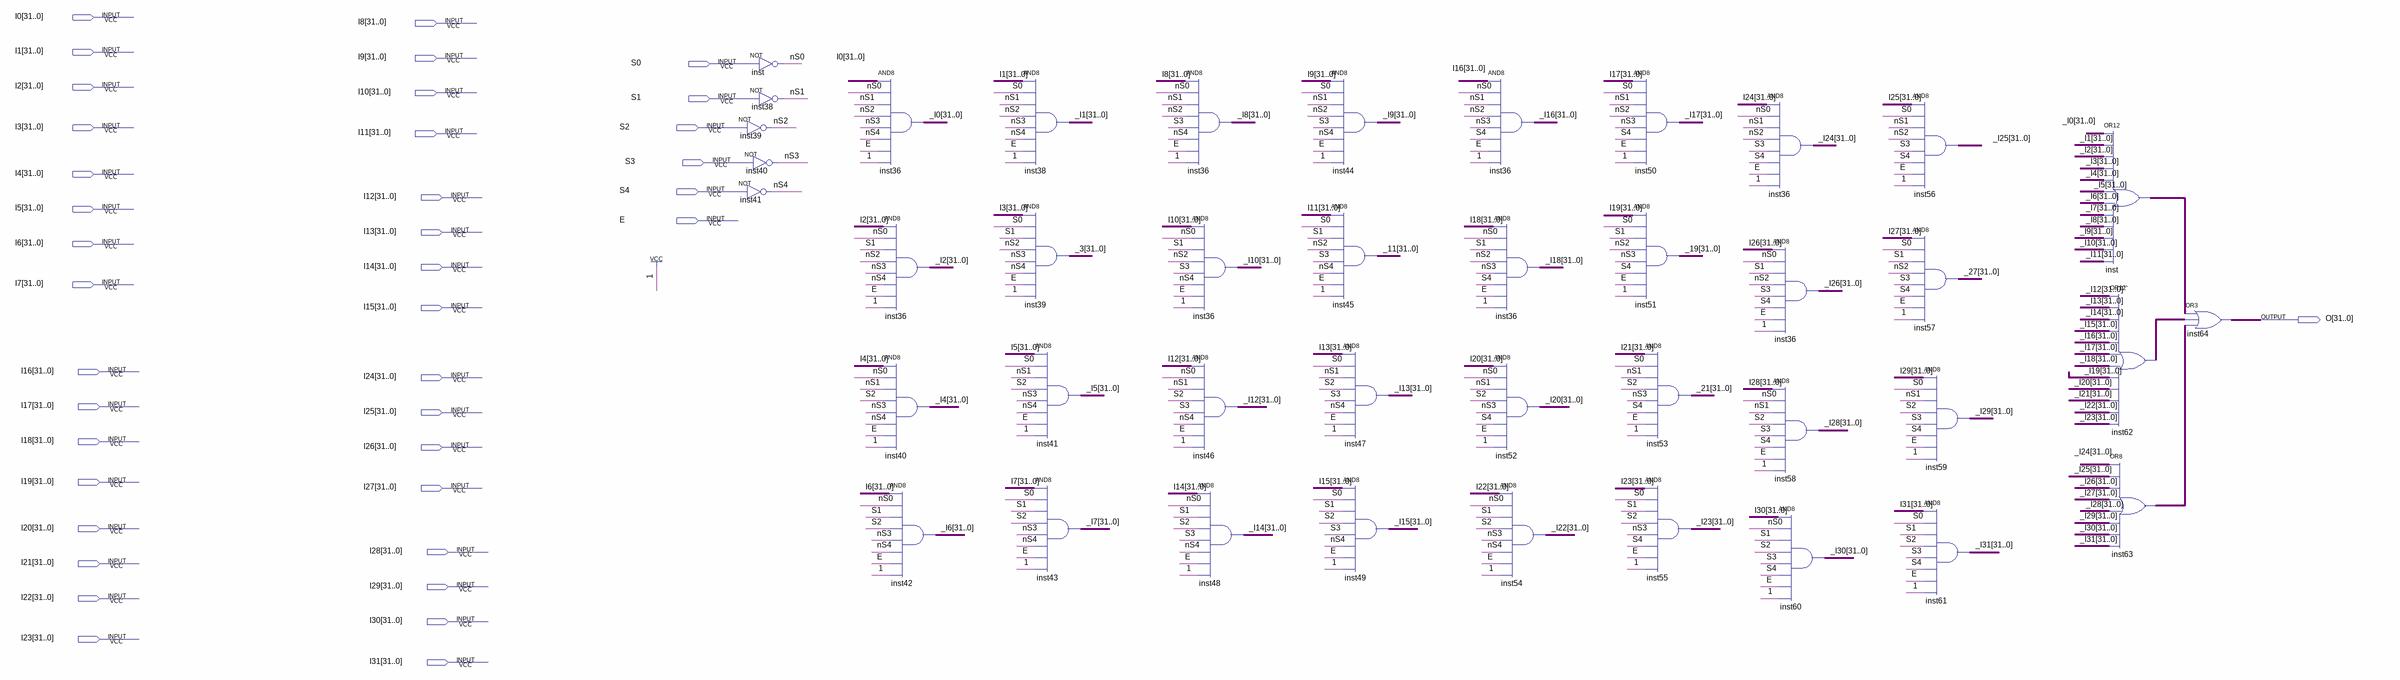
[diagram p0: schematic sheet]
// Quartus schematic MUX32_32.bdf as structural Verilog: 41 symbols, 39 pins
module MUX32_32 (
  input  [31:0] I0,
  input  [31:0] I8,
  input  [31:0] I1,
  input  [31:0] I9,
  input  S0,
  input  [31:0] I2,
  input  [31:0] I10,
  input  S1,
  input  [31:0] I3,
  input  S2,
  input  [31:0] I11,
  input  S3,
  input  [31:0] I4,
  input  S4,
  input  [31:0] I12,
  input  [31:0] I5,
  input  E,
  input  [31:0] I13,
  input  [31:0] I6,
  input  [31:0] I14,
  input  [31:0] I7,
  input  [31:0] I15,
  input  [31:0] I16,
  input  [31:0] I24,
  input  [31:0] I17,
  input  [31:0] I25,
  input  [31:0] I18,
  input  [31:0] I26,
  input  [31:0] I19,
  input  [31:0] I27,
  input  [31:0] I20,
  input  [31:0] I28,
  input  [31:0] I21,
  input  [31:0] I29,
  input  [31:0] I22,
  input  [31:0] I30,
  input  [31:0] I23,
  input  [31:0] I31,
  output [31:0] O
);

  wire \_I12[31..0]`` , nS0, nS1, nS2, nS3, nS4;
  wire [31:0] _3, _11, _19, _21, _27, _I0, _I1, _I2, _I3, _I4, _I5, _I6, _I7, _I8, _I9, _I10, _I11, _I12,
       _I13, _I14, _I15, _I16, _I17, _I18, _I19, _I20, _I21, _I22, _I23, _I24, _I25, _I26, _I27, _I28, _I29,
       _I30, _I31, inst62_out, inst63_out, inst_out;

  not inst (nS0, S0);
  not inst38 (nS1, S1);
  not inst39 (nS2, S2);
  not inst40 (nS3, S3);
  not inst41 (nS4, S4);
  assign _I0 = I0 & {32{nS0}} & {32{nS1}} & {32{nS2}} & {32{nS3}} & {32{nS4}} & {32{E}} & {32{1'b1}};  // AND8 inst36, 32 bits wide
  assign _I2 = I2 & {32{nS0}} & {32{S1}} & {32{nS2}} & {32{nS3}} & {32{nS4}} & {32{E}} & {32{1'b1}};  // AND8 inst36, 32 bits wide
  assign _I4 = I4 & {32{nS0}} & {32{nS1}} & {32{S2}} & {32{nS3}} & {32{nS4}} & {32{E}} & {32{1'b1}};  // AND8 inst40, 32 bits wide
  assign _I6 = I6 & {32{nS0}} & {32{S1}} & {32{S2}} & {32{nS3}} & {32{nS4}} & {32{E}} & {32{1'b1}};  // AND8 inst42, 32 bits wide
  assign _I1 = I1 & {32{S0}} & {32{nS1}} & {32{nS2}} & {32{nS3}} & {32{nS4}} & {32{E}} & {32{1'b1}};  // AND8 inst38, 32 bits wide
  assign _3 = I3 & {32{S0}} & {32{S1}} & {32{nS2}} & {32{nS3}} & {32{nS4}} & {32{E}} & {32{1'b1}};  // AND8 inst39, 32 bits wide
  assign _I5 = I5 & {32{S0}} & {32{nS1}} & {32{S2}} & {32{nS3}} & {32{nS4}} & {32{E}} & {32{1'b1}};  // AND8 inst41, 32 bits wide
  assign _I7 = I7 & {32{S0}} & {32{S1}} & {32{S2}} & {32{nS3}} & {32{nS4}} & {32{E}} & {32{1'b1}};  // AND8 inst43, 32 bits wide
  assign _I8 = I8 & {32{nS0}} & {32{nS1}} & {32{nS2}} & {32{S3}} & {32{nS4}} & {32{E}} & {32{1'b1}};  // AND8 inst36, 32 bits wide
  assign _I10 = I10 & {32{nS0}} & {32{S1}} & {32{nS2}} & {32{S3}} & {32{nS4}} & {32{E}} & {32{1'b1}};  // AND8 inst36, 32 bits wide
  assign _I12 = I12 & {32{nS0}} & {32{nS1}} & {32{S2}} & {32{S3}} & {32{nS4}} & {32{E}} & {32{1'b1}};  // AND8 inst46, 32 bits wide
  assign _I14 = I14 & {32{nS0}} & {32{S1}} & {32{S2}} & {32{S3}} & {32{nS4}} & {32{E}} & {32{1'b1}};  // AND8 inst48, 32 bits wide
  assign _I9 = I9 & {32{S0}} & {32{nS1}} & {32{nS2}} & {32{S3}} & {32{nS4}} & {32{E}} & {32{1'b1}};  // AND8 inst44, 32 bits wide
  assign _11 = I11 & {32{S0}} & {32{S1}} & {32{nS2}} & {32{S3}} & {32{nS4}} & {32{E}} & {32{1'b1}};  // AND8 inst45, 32 bits wide
  assign _I13 = I13 & {32{S0}} & {32{nS1}} & {32{S2}} & {32{S3}} & {32{nS4}} & {32{E}} & {32{1'b1}};  // AND8 inst47, 32 bits wide
  assign _I15 = I15 & {32{S0}} & {32{S1}} & {32{S2}} & {32{S3}} & {32{nS4}} & {32{E}} & {32{1'b1}};  // AND8 inst49, 32 bits wide
  assign _I16 = I16 & {32{nS0}} & {32{nS1}} & {32{nS2}} & {32{nS3}} & {32{S4}} & {32{E}} & {32{1'b1}};  // AND8 inst36, 32 bits wide
  assign _I18 = I18 & {32{nS0}} & {32{S1}} & {32{nS2}} & {32{nS3}} & {32{S4}} & {32{E}} & {32{1'b1}};  // AND8 inst36, 32 bits wide
  assign _I20 = I20 & {32{nS0}} & {32{nS1}} & {32{S2}} & {32{nS3}} & {32{S4}} & {32{E}} & {32{1'b1}};  // AND8 inst52, 32 bits wide
  assign _I22 = I22 & {32{nS0}} & {32{S1}} & {32{S2}} & {32{nS3}} & {32{nS4}} & {32{E}} & {32{1'b1}};  // AND8 inst54, 32 bits wide
  assign _I17 = I17 & {32{S0}} & {32{nS1}} & {32{nS2}} & {32{nS3}} & {32{S4}} & {32{E}} & {32{1'b1}};  // AND8 inst50, 32 bits wide
  assign _19 = I19 & {32{S0}} & {32{S1}} & {32{nS2}} & {32{nS3}} & {32{S4}} & {32{E}} & {32{1'b1}};  // AND8 inst51, 32 bits wide
  assign _21 = I21 & {32{S0}} & {32{nS1}} & {32{S2}} & {32{nS3}} & {32{S4}} & {32{E}} & {32{1'b1}};  // AND8 inst53, 32 bits wide
  assign _I23 = I23 & {32{S0}} & {32{S1}} & {32{S2}} & {32{nS3}} & {32{S4}} & {32{E}} & {32{1'b1}};  // AND8 inst55, 32 bits wide
  assign _I24 = I24 & {32{nS0}} & {32{nS1}} & {32{nS2}} & {32{S3}} & {32{S4}} & {32{E}} & {32{1'b1}};  // AND8 inst36, 32 bits wide
  assign _I26 = I26 & {32{nS0}} & {32{S1}} & {32{nS2}} & {32{S3}} & {32{S4}} & {32{E}} & {32{1'b1}};  // AND8 inst36, 32 bits wide
  assign _I28 = I28 & {32{nS0}} & {32{nS1}} & {32{S2}} & {32{S3}} & {32{S4}} & {32{E}} & {32{1'b1}};  // AND8 inst58, 32 bits wide
  assign _I30 = I30 & {32{nS0}} & {32{S1}} & {32{S2}} & {32{S3}} & {32{S4}} & {32{E}} & {32{1'b1}};  // AND8 inst60, 32 bits wide
  assign _I25 = I25 & {32{S0}} & {32{nS1}} & {32{nS2}} & {32{S3}} & {32{S4}} & {32{E}} & {32{1'b1}};  // AND8 inst56, 32 bits wide
  assign _27 = I27 & {32{S0}} & {32{S1}} & {32{nS2}} & {32{S3}} & {32{S4}} & {32{E}} & {32{1'b1}};  // AND8 inst57, 32 bits wide
  assign _I29 = I29 & {32{S0}} & {32{nS1}} & {32{S2}} & {32{S3}} & {32{S4}} & {32{E}} & {32{1'b1}};  // AND8 inst59, 32 bits wide
  assign _I31 = I31 & {32{S0}} & {32{S1}} & {32{S2}} & {32{S3}} & {32{S4}} & {32{E}} & {32{1'b1}};  // AND8 inst61, 32 bits wide
  assign inst_out = _I0 | _I1 | _I2 | _I3 | _I4 | _I5 | _I6 | _I7 | _I8 | _I9 | _I10 | _I11;  // OR12 inst, 32 bits wide
  assign inst62_out = {32{\_I12[31..0]`` }} | _I13 | _I14 | _I15 | _I16 | _I17 | _I18 | _I19 | _I20 | _I21 | _I22 | _I23;  // OR12 inst62, 32 bits wide
  assign inst63_out = _I24 | _I25 | _I26 | _I27 | _I28 | _I29 | _I30 | _I31;  // OR8 inst63, 32 bits wide
  assign O = inst_out | inst62_out | inst63_out;  // OR3 inst64, 32 bits wide
endmodule
